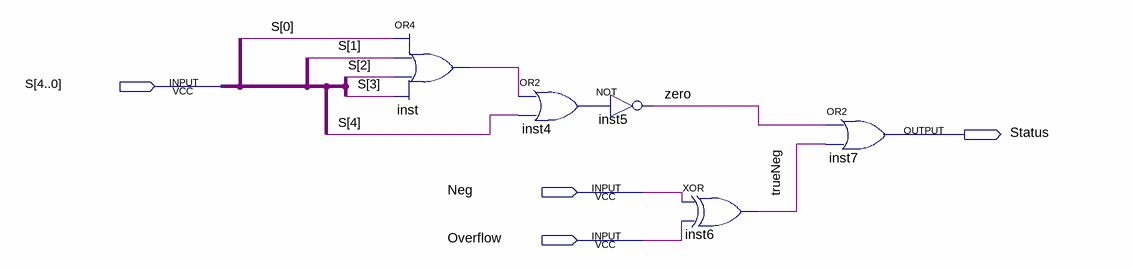
[diagram p0: schematic sheet]
// Quartus schematic Le_status.bdf as structural Verilog: 5 symbols, 4 pins
module Le_status (
  input  [4:0] S,
  input  Neg,
  input  Overflow,
  output Status
);

  wire inst4_out, inst_out, trueNeg, zero;

  or inst (inst_out, S[0], S[1], S[2], S[3]);
  or inst4 (inst4_out, inst_out, S[4]);
  not inst5 (zero, inst4_out);
  xor inst6 (trueNeg, Neg, Overflow);
  or inst7 (Status, zero, trueNeg);
endmodule
